# EAGLE schematic GoPiGo_Proto_10 (EAGLE 6.3)
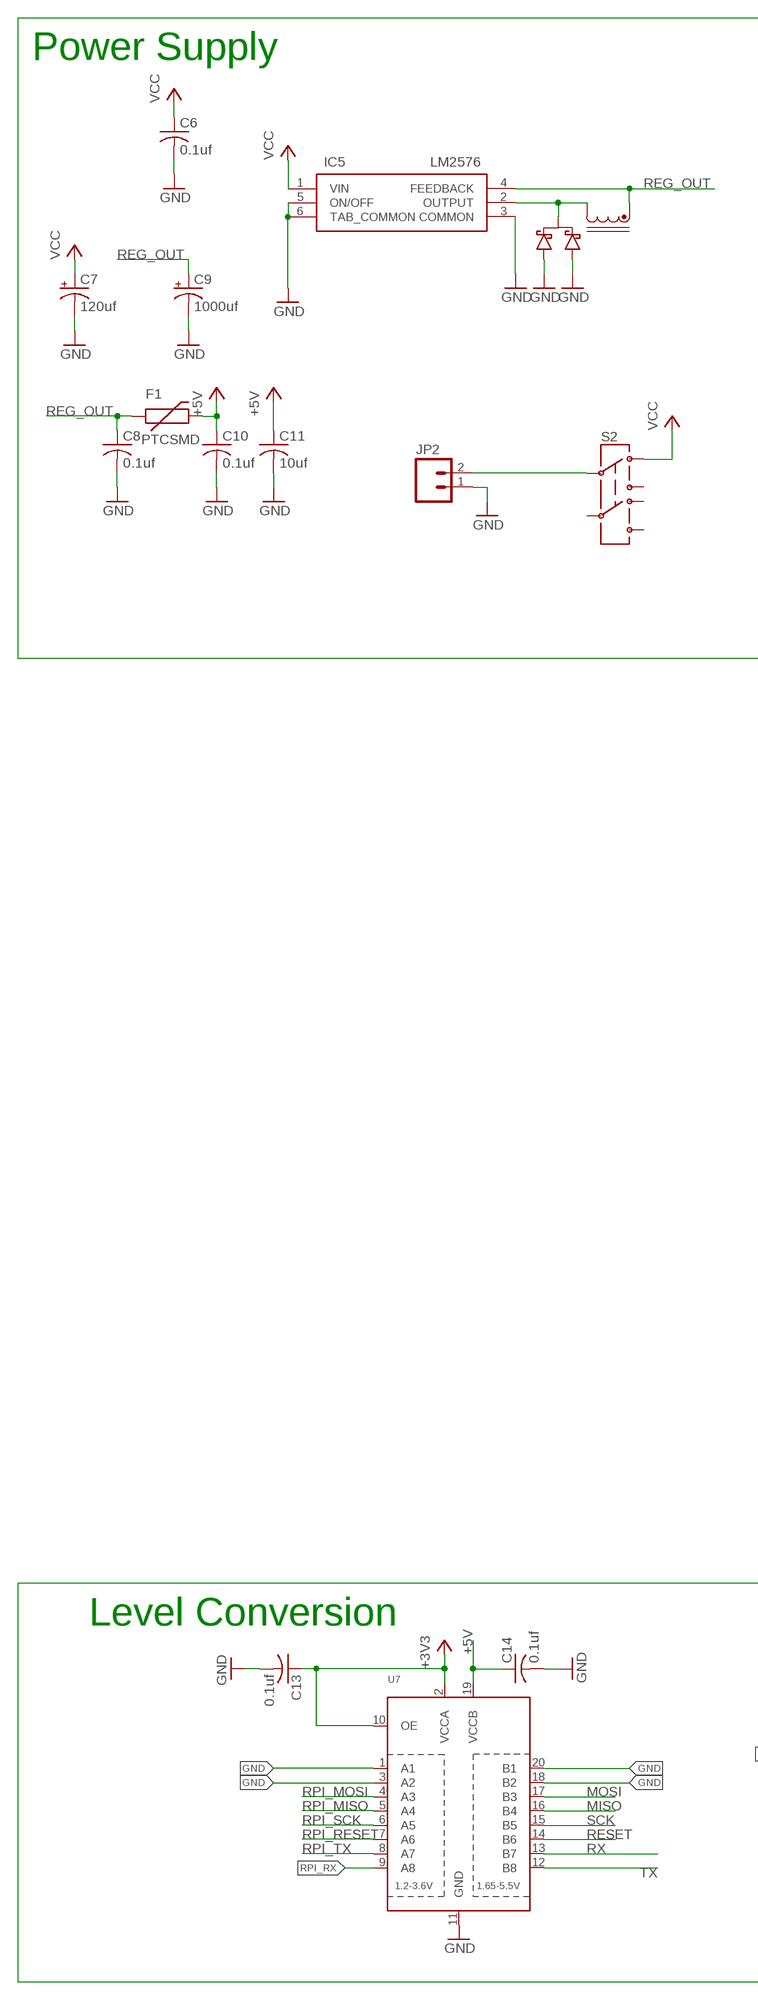
[diagram p0: schematic, sheet 1, part 1 of 2]
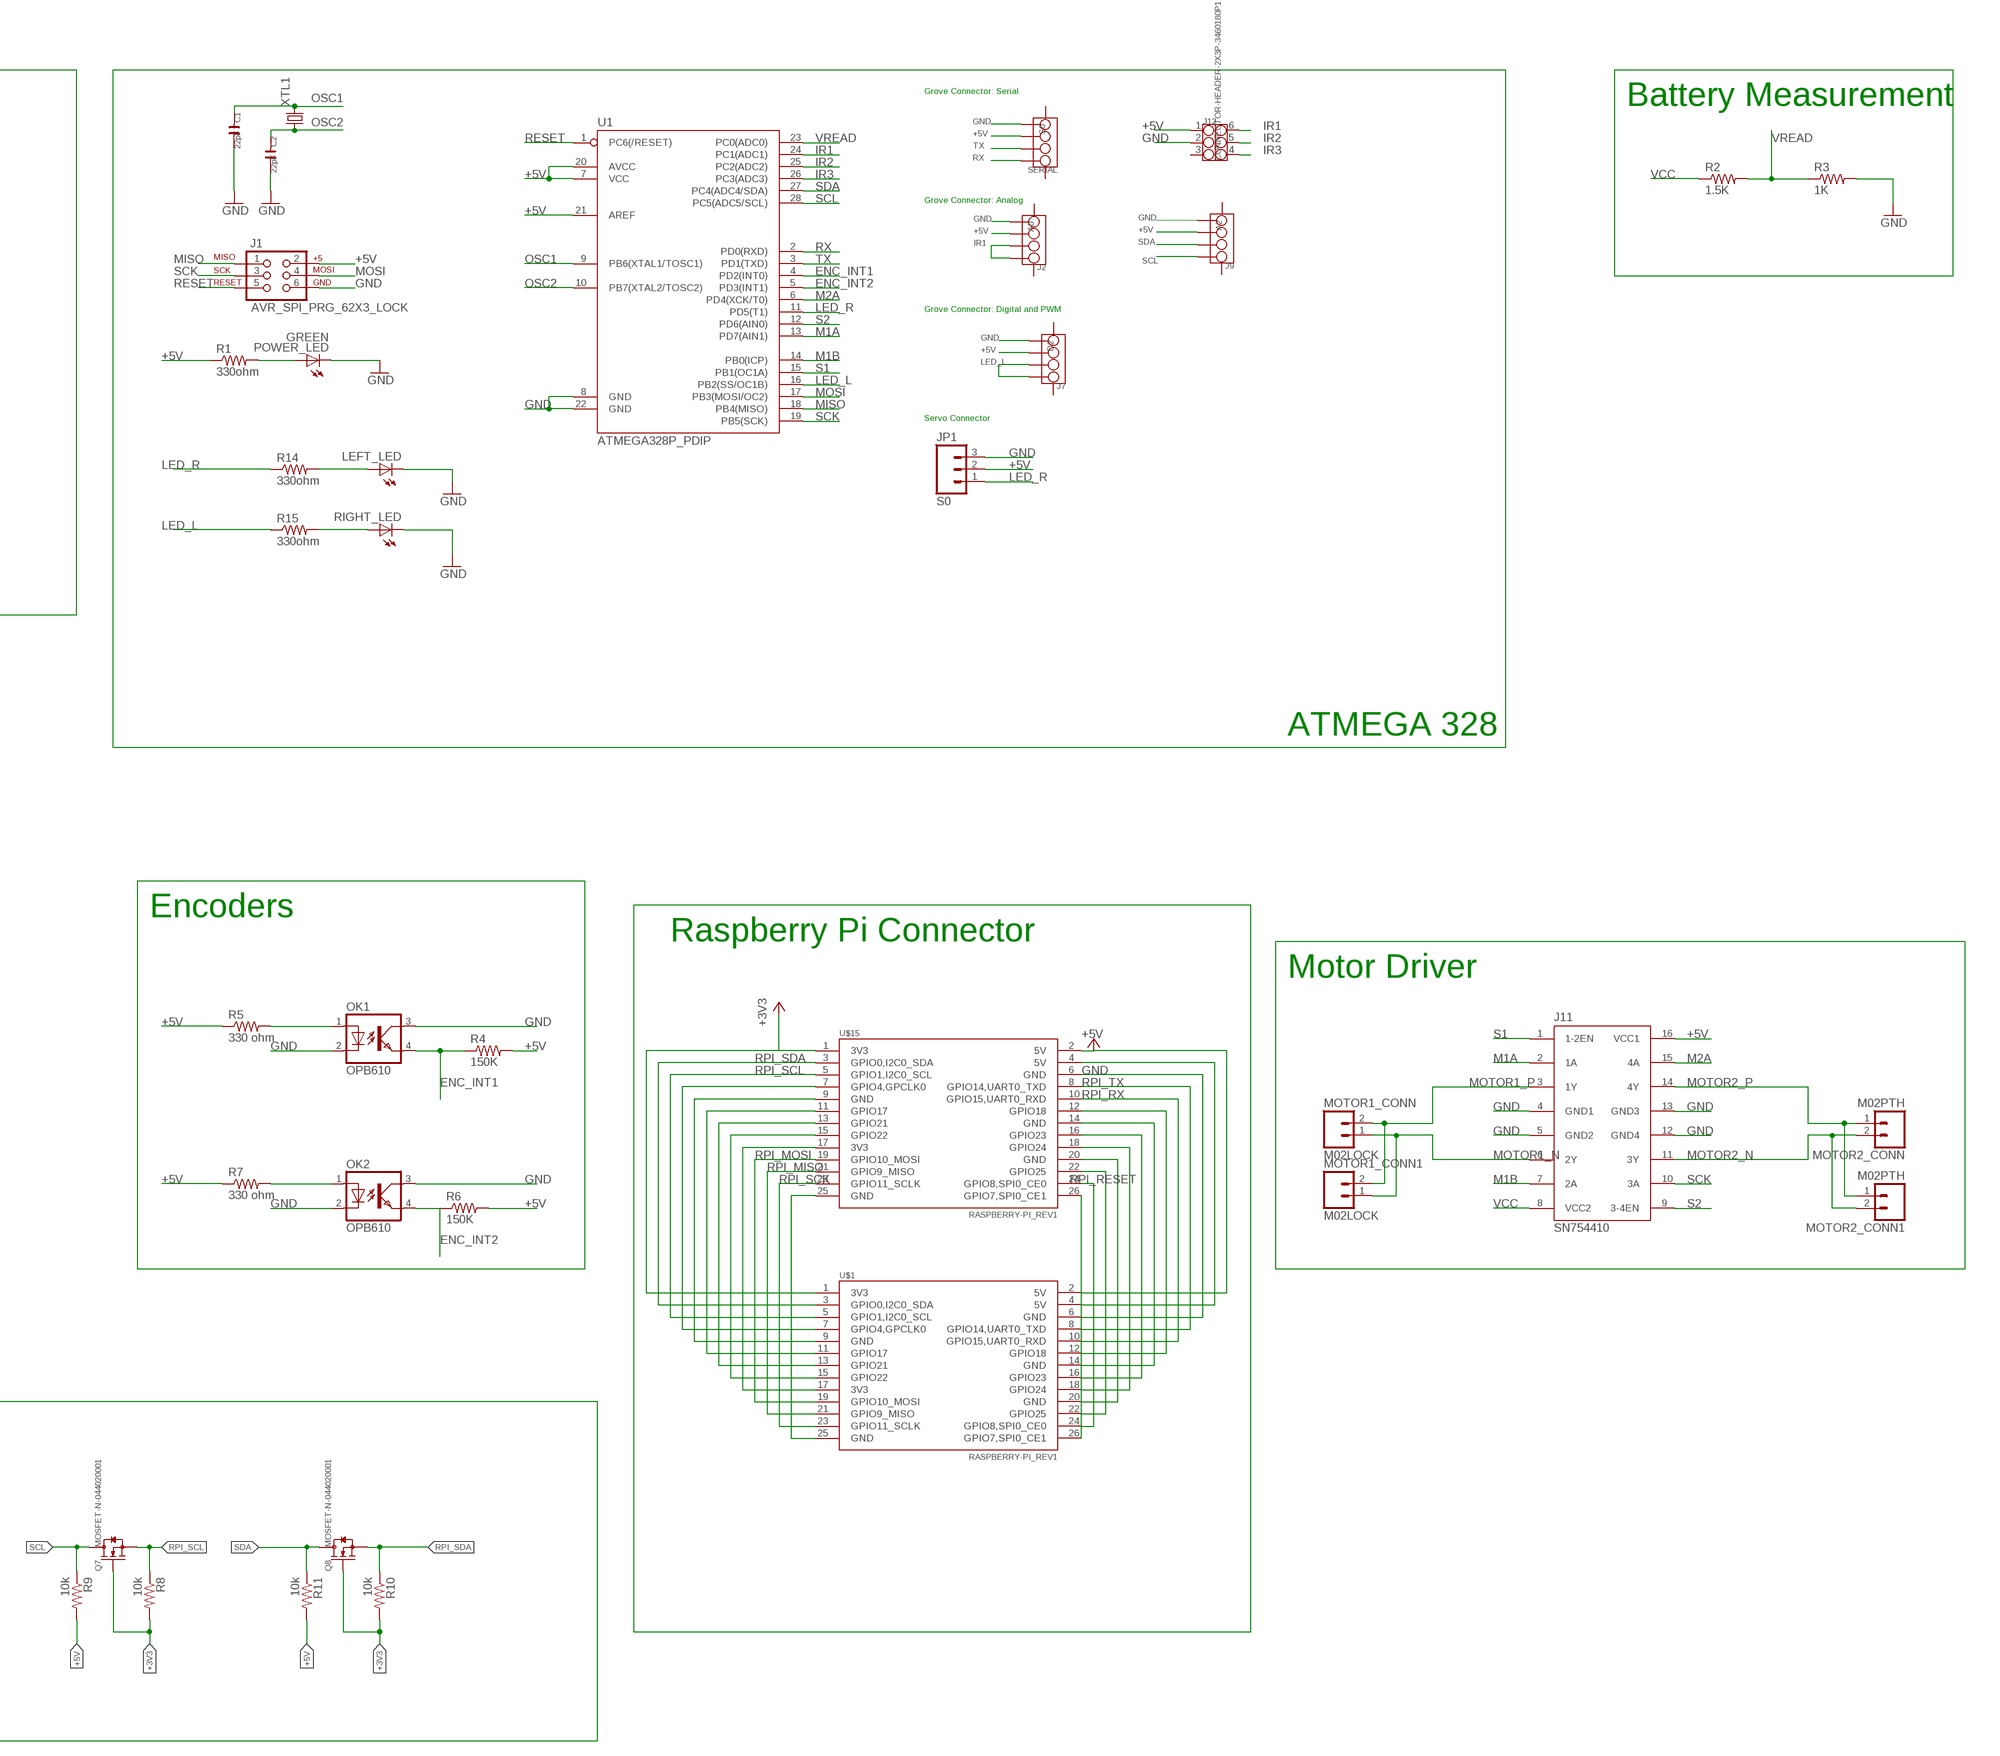
[diagram p1: schematic, sheet 1, part 2 of 2]

## Parts
C1  22pF  C-0805  [C0805]
C2  22pF  C-0805  [C0805]
C6  0.1uf  C-USC0603  [C0603]
C7  120uf  CPOL-USE2.5-6  [E2,5-6]
C8  0.1uf  C-USC0603  [C0603]
C9  1000uf  CPOL-USE5-13  [E5-13]
C10  0.1uf  C-USC0603  [C0603]
C11  10uf  C-USC0805  [C0805]
C13  0.1uf  C-USC0603  [C0603]
C14  0.1uf  C-USC0603  [C0603]
D1  DIODE_SCHOTTKY_VS-6CWQ04FNTRPBF  [DPAK]
F1  PTCSMD  [PTC-1206]
IC5  LM2576  REGULATOR_SWITCHING_LM2575_LM2576  [TO220-5-H]
J1  AVR_SPI_PRG_62X3_LOCK  [2X3_LOCK]
J2  A0  GROVE-4P-2.0-SMD-FEMALE-REINFORCE-3470120P1  [4P-SMD-2.0-90D]
J7  D2  GROVE-4P-2.0-SMD-FEMALE-REINFORCE-3470120P1  [4P-SMD-2.0-90D]
J9  A2  GROVE-4P-2.0-SMD-FEMALE-REINFORCE-3470120P1  [4P-SMD-2.0-90D]
J11  SN754410  L293D  [DIL16]
J12  CONNECTOR-HEADER-2X3P-3460180P1  [2X3P-2.54-2.54-11.6-3.0-BLACK-MALE]
JP1  S0  M03PTH  [1X03]
JP2  M02LOCK  [1X02_LOCK]
LEFT_LED  LED5MM  [LED5MM]
MOTOR1_CONN  M02LOCK  [1X02_LOCK]
MOTOR1_CONN1  M02LOCK  [1X02_LOCK]
MOTOR2_CONN  M02PTH  [1X02]
MOTOR2_CONN1  M02PTH  [1X02]
OK1  OPB610  SFH9310  [SFH9310]
OK2  OPB610  SFH9310  [SFH9310]
POWER_LED  GREEN  LED-GREEN0603  [LED-0603]
Q7  MOSFET-N-044020001  [SOT23]
Q8  MOSFET-N-044020001  [SOT23]
R1  330ohm  RESISTOR0603  [0603-RES]
R2  1.5K  RESISTOR0603  [0603-RES]
R3  1K  RESISTOR0603  [0603-RES]
R4  150K  RESISTOR0603  [0603-RES]
R5  330 ohm  RESISTOR0603  [0603-RES]
R6  150K  RESISTOR0603  [0603-RES]
R7  330 ohm  RESISTOR0603  [0603-RES]
R8  10k  RESISTOR0603  [0603-RES]
R9  10k  RESISTOR0603  [0603-RES]
R10  10k  RESISTOR0603  [0603-RES]
R11  10k  RESISTOR0603  [0603-RES]
R14  330ohm  RESISTOR0603  [0603-RES]
R15  330ohm  RESISTOR0603  [0603-RES]
RIGHT_LED  LED5MM  [LED5MM]
S2  SWITCH-DPDTOS  [OS]
SERIAL  S0  GROVE-4P-2.0-SMD-FEMALE-REINFORCE-3470120P1  [4P-SMD-2.0-90D]
U1  ATMEGA328P_PDIP  [DIL28-3]
U7  TXB0108PWR  [TSSOP20]
U$1  RASPBERRY-PI_REV1  [RASPBERRY-PI_REV1]
U$14  INDUCTOR_PULSE_P0250.XXXNL  [INDUCTOR_PULSE_P0250.XXXNL]
U$15  RASPBERRY-PI_REV1  [RASPBERRY-PI_REV1]
XTL1  CRYSTALHC49S  [HC49/S]

## Nets
+3V3: C13.1 Q7.1(G) Q8.1(G) R8.2 R10.2 U7.2(VCCA) U7.10(OE) U$1.1(3V3) U$15.1(3V3)
+5V [POWER]: C10.1 C11.1 C14.1 F1.2 J1.2 J2.3 J7.3 J9.3 J11.16(VCC1) J12.1 JP1.2 R1.1 R4.2 R5.1 R6.2 R7.1 R9.2 R11.2 SERIAL.3 U1.7(VCC) U1.20(AVCC) U1.21(AREF) U7.19(VCCB) U$1.2(5V) U$15.2(5V)
ENC_INT1: OK1.4(EMIT) R4.1 U1.4(PD2(INT0))
ENC_INT2: OK2.4(EMIT) R6.1 U1.5(PD3(INT1))
GND [POWER]: C1.2 C2.2 C6.2 C7.- C8.2 C9.- C10.2 C11.2 C13.2 C14.2 D1.1 D1.3 IC5.3(COMMON) IC5.5(ON/OFF) IC5.6(TAB_COMMON) J1.6 J2.4 J7.4 J9.4 J11.4(GND1) J11.5(GND2) J11.12(GND4) J11.13(GND3) J12.2 JP1.3 JP2.1 LEFT_LED.K(C) OK1.2(C) OK1.3(COL) OK2.2(C) OK2.3(COL) POWER_LED.C R3.2 RIGHT_LED.K(C) SERIAL.4 U1.8(GND) U1.22(GND) U7.1(A1) U7.3(A2) U7.11(GND) U7.18(B2) U7.20(B1) U$1.6(GND) U$15.6(GND)
IR1: J2.1 J2.2 J12.6 U1.24(PC1(ADC1))
IR2: J12.5 U1.25(PC2(ADC2))
IR3: J12.4 U1.26(PC3(ADC3))
LED_L: J7.1 J7.2 R15.1 U1.16(PB2(SS/OC1B))
LED_R: JP1.1 R14.1 U1.11(PD5(T1))
M1A: J11.2(1A) U1.13(PD7(AIN1))
M1B: J11.7(2A) U1.14(PB0(ICP))
M2A: J11.15(4A) U1.6(PD4(XCK/T0))
MISO: J1.1 U1.18(PB4(MISO)) U7.16(B4)
MOSI: J1.4 U1.17(PB3(MOSI/OC2)) U7.17(B3)
MOTOR1_N: J11.6(2Y) MOTOR1_CONN1.1 MOTOR1_CONN.1
MOTOR1_P [POWER]: J11.3(1Y) MOTOR1_CONN1.2 MOTOR1_CONN.2
MOTOR2_N [POWER]: J11.11(3Y) MOTOR2_CONN1.2 MOTOR2_CONN.2
MOTOR2_P: J11.14(4Y) MOTOR2_CONN1.1 MOTOR2_CONN.1
N$1: D1.4 IC5.2(OUTPUT) U$14.P$2
N$3: OK2.1(A) R7.2
N$5: OK1.1(A) R5.2
N$11: POWER_LED.A R1.2
N$13: LEFT_LED.A R14.2
N$14: R15.2 RIGHT_LED.A
N$16: JP2.2 S2.2
N$48: U$1.7(GPIO4,GPCLK0) U$15.7(GPIO4,GPCLK0)
N$49: U$1.9(GND) U$15.9(GND)
N$50: U$1.11(GPIO17) U$15.11(GPIO17)
N$51: U$1.13(GPIO21) U$15.13(GPIO21)
N$52: U$1.15(GPIO22) U$15.15(GPIO22)
N$53: U$1.17(3V3) U$15.17(3V3)
N$54: U$1.25(GND) U$15.25(GND)
N$59: U$1.26(GPIO7,SPI0_CE1) U$15.26(GPIO7,SPI0_CE1)
N$61: U$1.22(GPIO25) U$15.22(GPIO25)
N$62: U$1.20(GND) U$15.20(GND)
N$63: U$1.18(GPIO24) U$15.18(GPIO24)
N$64: U$1.16(GPIO23) U$15.16(GPIO23)
N$65: U$1.14(GND) U$15.14(GND)
N$66: U$1.12(GPIO18) U$15.12(GPIO18)
N$69: U$1.4(5V) U$15.4(5V)
OSC1: C1.1 U1.9(PB6(XTAL1/TOSC1)) XTL1.2
OSC2: C2.1 U1.10(PB7(XTAL2/TOSC2)) XTL1.1
REG_OUT [POWER]: C8.1 C9.+ F1.1 IC5.4(FEEDBACK) U$14.P$1
RESET: J1.5 U1.1(PC6(/RESET)) U7.14(B6)
RPI_MISO: U7.5(A4) U$1.21(GPIO9_MISO) U$15.21(GPIO9_MISO)
RPI_MOSI: U7.4(A3) U$1.19(GPIO10_MOSI) U$15.19(GPIO10_MOSI)
RPI_RESET: U7.7(A6) U$1.24(GPIO8,SPI0_CE0) U$15.24(GPIO8,SPI0_CE0)
RPI_RX: U7.9(A8) U$1.10(GPIO15,UART0_RXD) U$15.10(GPIO15,UART0_RXD)
RPI_SCK: U7.6(A5) U$1.23(GPIO11_SCLK) U$15.23(GPIO11_SCLK)
RPI_SCL: Q7.2(S) R8.1 U$1.5(GPIO1,I2C0_SCL) U$15.5(GPIO1,I2C0_SCL)
RPI_SDA: Q8.2(S) R10.1 U$1.3(GPIO0,I2C0_SDA) U$15.3(GPIO0,I2C0_SDA)
RPI_TX: U7.8(A7) U$1.8(GPIO14,UART0_TXD) U$15.8(GPIO14,UART0_TXD)
RX: SERIAL.1 U1.2(PD0(RXD)) U7.13(B7)
S1: J11.1(1-2EN) U1.15(PB1(OC1A))
S2: J11.9(3-4EN) U1.12(PD6(AIN0))
SCK: J1.3 J11.10(3A) U1.19(PB5(SCK)) U7.15(B5)
SCL: J9.1 Q7.3(D) R9.1 U1.28(PC5(ADC5/SCL))
SDA: J9.2 Q8.3(D) R11.1 U1.27(PC4(ADC4/SDA))
TX: SERIAL.2 U1.3(PD1(TXD)) U7.12(B8)
VCC [POWER]: C6.1 C7.+ IC5.1(VIN) J11.8(VCC2) R2.1 S2.1
VREAD: R2.2 R3.1 U1.23(PC0(ADC0))
Unconnected: J2.SS1 J2.SS2 J7.SS1 J7.SS2 J9.SS1 J9.SS2 J12.3 S2.3 S2.4 S2.5 S2.6 SERIAL.SS1 SERIAL.SS2

## Notes on the sheet
- Grove Connector: Serial
- Power Supply | Battery Measurement
- Grove Connector: Analog
- Grove Connector: Digital and PWM
- Servo Connector
- ATMEGA 328
- Encoders
- Raspberry Pi Connector
- Motor Driver
- Level Conversion

## Library data of the parts
C1 C2 = OPL:C*
C6 C8 C10 C13 C14 = resistor:C-US: CAPACITOR, American symbol
C7 C9 = rcl:CPOL-US: POLARIZED CAPACITOR, American symbol
C11 = rcl:C-US: CAPACITOR, American symbol
D1 = zz My Parts:DIODE_SCHOTTKY_VS-6CWQ04FNTRPBF
F1 = zz SparkFun:PTC: Resettable Fuse PTC Resettable Fuse. Spark Fun Electronics SKU : COM-08357
IC5 = zz My Parts:REGULATOR_SWITCHING_LM2575_LM2576
J1 = SparkFun-Connectors:AVR_SPI_PRG_6: AVR ISP 6 Pin This is the reduced ISP connector for AVR programming. Common on Arduino. This footprint will take up less PCB space and can be used with a 10-pin to 6-pin adapter such as SKU: BOB-08508
J2 J7 J9 SERIAL = OPL Eagle Library:GROVE-4P-2.0-SMD-FEMALE-REINFORCE
J11 = st-microelectronics:L293D: PUSH-PULL 4 CHANNEL DRIVER; OC_FARNELL: 9589619; OC_NEWARK: 56P8249
J12 = OPL Eagle Library:CONNECTOR-HEADER-2X3P
JP1 = SparkFun-Connectors:M03: Header 3 Standard 3-pin 0.1" header. Use with straight break away headers (SKU : PRT-00116), right angle break away headers (PRT-00553), swiss pins (PRT-00743), machine pins (PRT-00117), and female headers (PRT-00115). Molex polarized connector foot print use with SKU : PRT-08232 with associated crimp pins and housings.
JP2 = zz SparkFun:M02: Header 2 Standard 2-pin 0.1" header. Use with straight break away headers (SKU : PRT-00116), right angle break away headers (PRT-00553), swiss pins (PRT-00743), machine pins (PRT-00117), and female headers (PRT-00115). Molex polarized connector foot print use with SKU : PRT-08233 with associated crimp pins and housings.
LEFT_LED RIGHT_LED = SparkFun-LED:LED: LEDs Standard schematic elements and footprints for 5mm, 3mm, 1206, and 0603 sized LEDs. 5mm - Spark Fun Electronics SKU : COM-00529 (and others)
MOTOR1_CONN MOTOR1_CONN1 MOTOR2_CONN MOTOR2_CONN1 = SparkFun-Connectors:M02: Standard 2-pin 0.1" header. Use with - straight break away headers ( PRT-00116) - right angle break away headers (PRT-00553) - swiss pins (PRT-00743) - machine pins (PRT-00117) - female headers (PRT-00115) Molex polarized connector foot print use with: PRT-08233 with associated crimp pins and housings. 2.54_SCREWTERM for use with PRT-10571. 3.5mm Screw Terminal footprints for PRT-08084 5mm Screw Terminal footprints for use with PRT-08433
OK1 OK2 = optocoupler:SFH9*: Slotted Interrupter / Gabellichtschranke Source: http://www.osram.convergy.de/; OC_FARNELL: unknown; OC_NEWARK: unknown
POWER_LED = SparkFun-LED:LED-GREEN: Various green LEDs 0603- DIO-00821 LARGE- DIO-00862 LILYPAD- DIO-09910; PROD_ID: DIO-00821
Q7 Q8 = OPL:MOSFET-N: CJ2302：SMD MOSFET N-CH 20V-2.1A
R1-R11 R14 R15 = SparkFun-Resistors:RESISTOR: Resistor Basic schematic elements and footprints for 0603, 1206, and PTH resistors.
S2 = SparkFun-Electromechanical1:SWITCH-DPDT: DPDT Version of the COM-00597
U1 = SparkFun-DigitalIC:ATMEGA328P_PDIP: uC used in the Arduino 32kb flash, 1k EEPROM, 2k SRAM This is the through-hole version of this chip.
U7 = adafruit:TXB0108PWR: 8-Bit Bi-Directional Level Shifter 1.2V-3.6V (VCCA) to 1.65V-5.5V (VCCB) bi-directional level shifter with auto direction sensing. Max data rate - VCCA 1.8V: 20Mbps (50ns), VCCA 3.3V: 100Mbps (10ns) Digikey: 296-21527-1-ND
U$1 U$15 = RaspberryPi:RASPBERRY-PI_REV1: Raspberry Pi Board <http://www.raspberrypi.org/> Jacques Lagnel V1.0 (beta) 2012 Mateusz Bawaj V1.1 (beta) 2012 Board dimension: Forum 3D model <http://www.raspberrypi.org/forum/general-discussion/mechanical-profile-3d-models?value=3d%20model&type=1&include=1&search=1&ret=all> The GPIO Connector (P1): http://elinux.org/RPi_Low-level_peripherals
U$14 = zz My Parts:INDUCTOR_PULSE_P0250.XXXNL
XTL1 = crystal:CRYSTAL: CRYSTAL; OC_FARNELL: 1667008; OC_NEWARK: unknown

## Net classes
1 DATA: width 0.203 mm, drill 0.305 mm, clearance 0.051 mm
2 POWER: width 0.152 mm, drill 0.356 mm, clearance 0.051 mm